# Altium schematic sheet header_connect_class_II.SchDoc
size A4; SheetNumber: 2; SheetTotal: 6
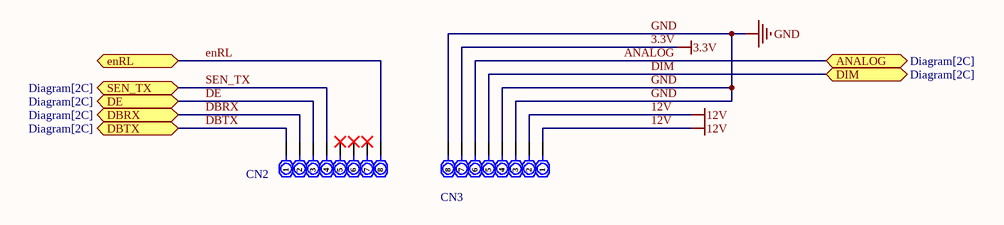
[diagram p0: header_connect_class_II.SchDoc]

## Parts
CN2  LEFT  [CON.HDR1X8]  (value not drawn)
CN3  RIGHT  [CON.HDR1X8]  (value not drawn)

## Ports
ANALOG (bidir, see Diagram[2C]), DBRX (bidir, see Diagram[2C]), DBTX (bidir, see Diagram[2C]), DE (bidir, see Diagram[2C]), DIM (bidir, see Diagram[2C]), enRL (bidir), SEN_TX (bidir, see Diagram[2C])

## Nets
3.3V: CN3.7
12V: CN3.1 CN3.2
GND: CN3.3 CN3.4 CN3.8
ANALOG: CN3.6 ; port ANALOG
DBRX: CN2.2 ; port DBRX
DBTX: CN2.1 ; port DBTX
DE: CN2.3 ; port DE
DIM: CN3.5 ; port DIM
enRL: CN2.8 ; port enRL
SEN_TX: CN2.4 ; port SEN_TX

Not connected (* = marked no-connect by the designer): CN2 5* 6* 7*

## Library data of the parts
CN2 CN3 = CON.HDR1x8: Header 1x5; Publisher: Hoang Nguyen; ComponentLink1Description: Digikey Part link; ComponentLink2Description: Open DataSheet; ComponentLink2URL: H:\LIBRARY\LIBRARY.Datasheet\